# Altium project TNY275.PrjPcb
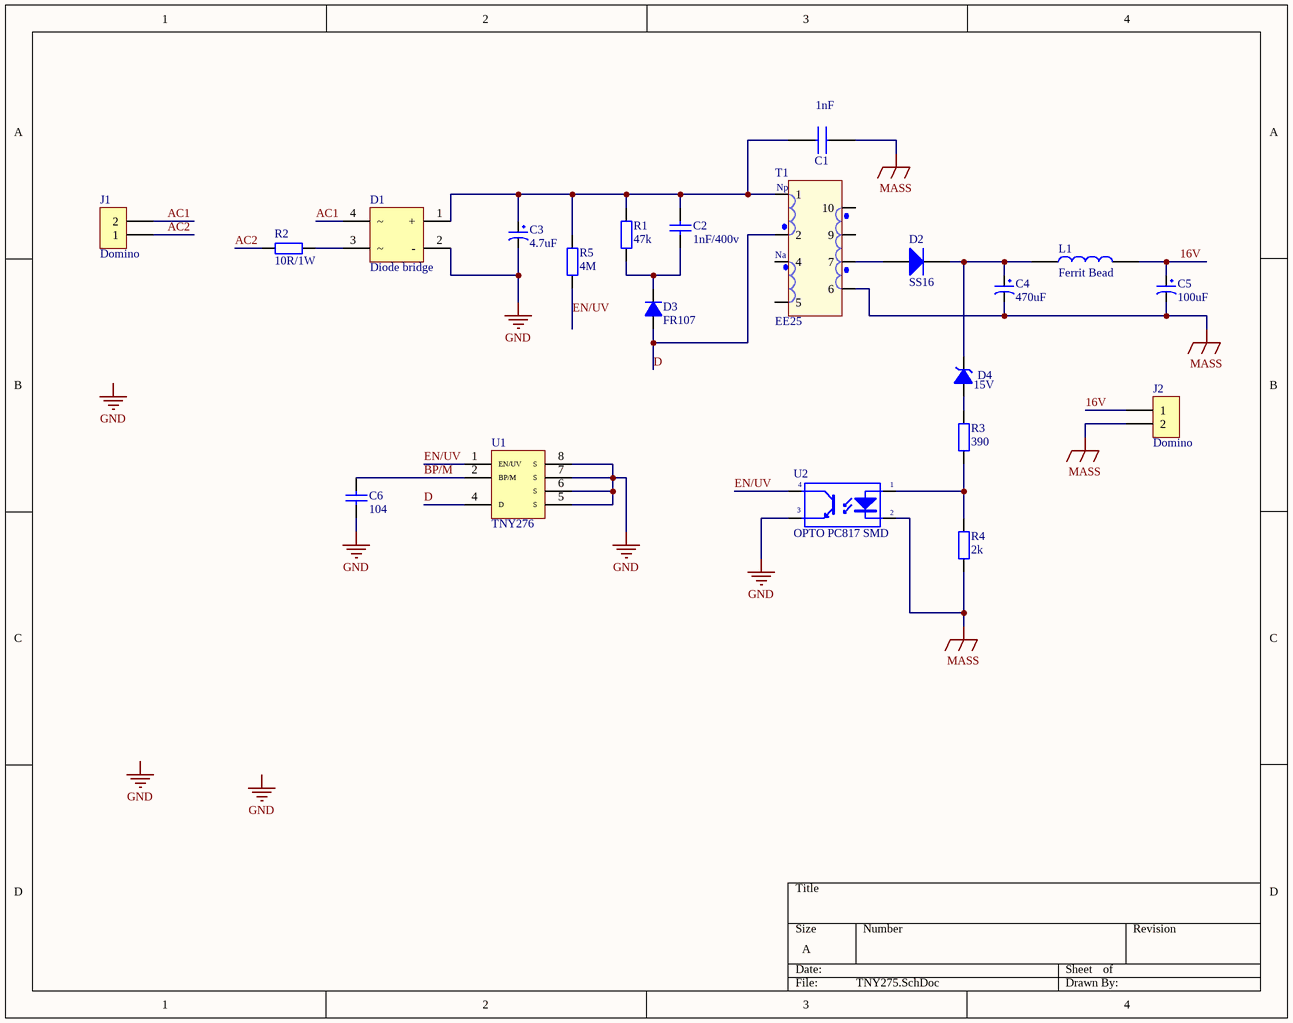
[diagram p0: TNY275.SchDoc]
1 sheet, 21 parts. Net scope: global (net labels, ports and power ports of the same name join across sheets).
Board file: TNY276 DEMO1.PcbDoc

## Sheet TNY275.SchDoc
size A; SheetNumber: 1; SheetTotal: 1

### Parts
C1  1nF  [Tenta capacitor]
C2  1nF/400v  [tu tantalum dip5.08]
C3  4.7uF  [tu hoa 8mm]
C4  470uF  [tu hoa 8mm]
C5  100uF  [tu hoa 5mm]
C6  104  [tu 0805]
D1  Diode bridge  [DS207S]
D2  SS16  [DIODE SMA]
D3  FR107  [DIODE 2A]
D4  15V  [DZ1A]
J1  Domino  [Domino]
J2  Domino  [Domino]
L1  Ferrit Bead  [CUON CAM]
R1  47k  [tro smd 0805]
R2  10R/1W  [tro vach 1w]
R3  390  [tro smd 0805]
R4  2k  [tro smd 0805]
R5  4M  [tro smd 0805]
T1  EE25  [EE25_0.5]
U1  TNY276  [PCBComponent_1]
U2  OPTO PC817 SMD  [SOP4]

### Nets
GND: C3.2 C6.2 D1.2(-) U1.5(S) U1.6(S) U1.7(S) U1.8(S) U2.3(E)
MASS: C1.2 C4.2 C5.2 J2.2 R4.1 T1.6 U2.2(K)
16V: C5.1 J2.1 L1.2
AC1: D1.4 J1.2
AC2: J1.1 R2.1
BP/M: C6.1 U1.2(BP/M)
D: D3.1(A) T1.2 U1.4(D)
EN/UV: R5.1 U1.1(EN/UV) U2.4(C)
NetC1_1: C1.1 C2.1 C3.1 D1.1(+) R1.2 R5.2 T1.1
NetC2_2: C2.2 D3.2(K) R1.1
NetC4_1: C4.1 D2.2(K) D4.2(K) L1.1
NetD1_3: D1.3 R2.2
NetD2_1: D2.1(A) T1.7
NetD4_1: D4.1(A) R3.2
NetR3_1: R3.1 R4.2 U2.1(A)

Not connected (* = marked no-connect by the designer): T1 4 5 9 10

### Notes on the sheet
- Labels drawn without touching a wire or pin: GND
- (in symbol EE25) Np; Na

### Library data of the parts
C1 = Tenta capacitor: ...nF +/-10% 275VAC 15 Through Hole Suppression Capacitors; Manufacturer_Name: Tenta; Manufacturer_Part_Number: MEX104K275A; Geometry.Height: 9.5mm; Mouser Part Number: *; Mouser Price/Stock: *; Arrow Part Number: *; Arrow Price/Stock: *; Datasheet Link: https://datasheet.lcsc.com/szlcsc/1811021609_TENTA-ELEC-INDUSTRIAL-MEX104K275A41_C8971.pdf
C2 = Tu tantalum 10nF DIP5.08: tụ cao áp Cắm; Don_Vi: Con; So_Chan: 2; Ten_Linh_Kien: Tụ tantalum 103-10nF DIP5.08 (sứ vàng)(10PCS); Ma_Hang: MH002105; Chung_Loai: Cắm; Kieu_Chan: *
C3 = Tu Hoa 4.7uF 400V 8x12: Cắm; Don_Vi: Con; So_Chan: 2; Ten_Linh_Kien: Tụ Hóa 4.7uF 400V 8x12MM; Ma_Hang: MH003744; Chung_Loai: Cắm; Kieu_Chan: *
C4 = Tu Hoa 470uF 25V 8x13: Cắm; Don_Vi: Con; So_Chan: 2; Ten_Linh_Kien: Tụ Hóa 470uF 25V; Ma_Hang: MH 470uF 25V; Chung_Loai: Cắm; Kieu_Chan: *
C5 = Tu Hoa 100uF 25V 6x11: Cắm; Don_Vi: Con; So_Chan: 2; Ten_Linh_Kien: Tụ Hóa 100uF 25V 6x11MM; Ma_Hang: MH001351; Chung_Loai: Cắm; Kieu_Chan: *
C6 = Tu 0805 104 50V 10%: Dán; Don_Vi: Con; So_Chan: 2; Ten_Linh_Kien: Tụ 0805 104-100nF 10% 50V; Ma_Hang: MH004551; Chung_Loai: Dán; Kieu_Chan: *
D1 = DS207S: Diode cau 2A 1000V
D2 = Diode SS14 ( 1N5819): Dán; Ma_Hang: MH002211; Don_Vi: Con; Ten_Linh_Kien: Diode SS14 DO214 Schottky 1A 40V ( 1N5819 DO214); Chung_Loai: Dán; Ghi_Chu: *; Kieu_Chan: *
D3 = Diode FR207: Cắm; Ten_Linh_Kien: Diode FR207 2A 1000V ( DIP); Don_Vi: Con; Ma_Hang: MH005704; Ghi Chu: *; Kieu_Chan: *; Chung_Loai: Cắm
D4 = DZ: Diode Zenner; Value: 3v3
J1 J2 = Domino: Domino 5.04mm
L1 = CUON CAM 470uH DIP: Cuộn lọc RH3.5x9x0.8 Cắm; Don_Vi: Con; Ma_Hang: MH002232; Ten_Linh_Kien: Cuộn Cảm 470uH 3A 8x10MM; Ghi_Chu: *; Kieu_Chan: *; Chung_Loai: Cắm
R1 R5 = Tro 0805 5% 47k: Dán; Don_Vi: Con; So_Chan: 2; Ten_Linh_Kien: Trở 0805 5% 47k; Ma_Hang: MH005320; Chung_Loai: Dán; Kieu_Chan: *
R2 = Tro Vach 1W 5% 3.3R: Cắm; Don_Vi: Con; So_Chan: 2; Ten_Linh_Kien: Trở 5% 1w 3.3R; Ma_Hang: MH008003; Chung_Loai: Cắm; Kieu_Chan: *
R3 = Tro 0805 5% 2.2k: Dán; Don_Vi: Con; So_Chan: 2; Ten_Linh_Kien: Trở 0805 5% 2.2k; Ma_Hang: MH005237; Chung_Loai: Dán; Kieu_Chan: *
R4 = Tro 0805 5% 220R: Dán; Don_Vi: Con; So_Chan: 2; Ten_Linh_Kien: Trở 0805 5% 220R; Ma_Hang: MH005259; Chung_Loai: Dán; Kieu_Chan: *
T1 = EE25: EE25 10PIN
U1 = TNY276: TNY274-280 / TinySwitch-III Family - DIP/PDIP-8C
U2 = OPTO PC817 SMD: Single Opto; Value: PC817